# Altium schematic sheet QXZ-v1.0.SchDoc
size A4
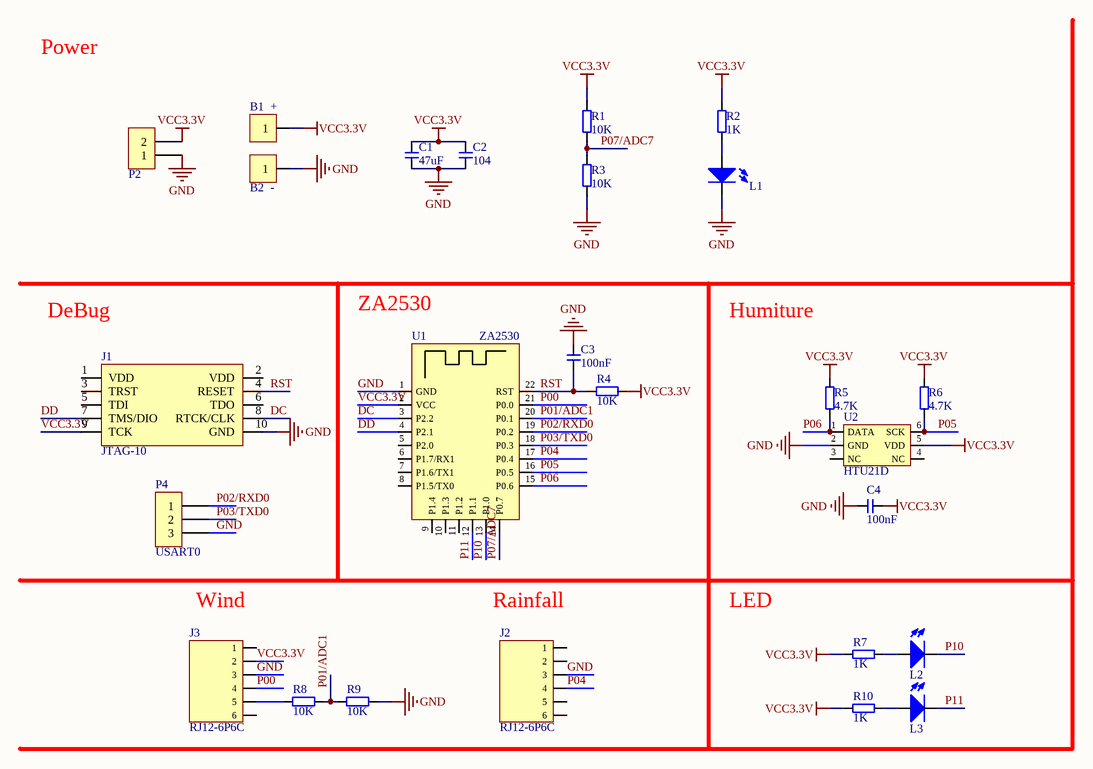
[diagram p0: QXZ-v1.0.SchDoc]

## Parts
B1  +  [BatteryContacts-5#]
B2  -  [BatteryContacts-5#]
C1  47uF  [CAP(0805)]
C2  104  [CAP(0603)]
C3  100nF  [CAP(0603)]
C4  100nF  [CAP(0603)]
J1  JTAG-10  [JTAG-10]
J2  RJ12-6P6C  [RJ12-6P6C-up]
J3  RJ12-6P6C  [RJ12-6P6C-up]
L1  LED  [led0805]  (value not drawn)
L2  LED  [led0805]  (value not drawn)
L3  LED  [led0805]  (value not drawn)
P2  Header2  [Header2]  (value not drawn)
P4  USART0  [HEADER3]
R1  10K  [RES0603]
R2  1K  [RES0603]
R3  10K  [RES0603]
R4  10K  [RES0603]
R5  4.7K  [RES0603]
R6  4.7K  [RES0603]
R7  1K  [RES0603]
R8  10K  [RES0603]
R9  10K  [RES0603]
R10  1K  [RES0603]
U1  ZA2530  [ZA2530A]
U2  HTU21D  [DFN6]

## Nets
GND: B2.1 C1.1 C2.1 C3.2 C4.1 J1.10(GND) J2.3 J3.3 L1.2 P2.1 P4.3 R3.1 R9.2 U1.1(GND) U2.2(GND)
VCC3.3V: B1.1 C1.2 C2.2 C4.2 J1.9(TCK) J3.2 P2.2 R1.2 R2.2 R4.2 R5.2 R6.2 R7.1 R10.1 U1.2(VCC) U2.5(VDD)
DC: J1.8(RTCK/CLK) U1.3(P2.2)
DD: J1.7(TMS/DIO) U1.4(P2.1)
P00: J3.4 U1.21(P0.0)
P01/ADC1: R8.2 R9.1 U1.20(P0.1)
P02/RXD0: P4.1 U1.19(P0.2)
P03/TXD0: P4.2 U1.18(P0.3)
P04: J2.4 U1.17(P0.4)
P05: R6.1 U1.16(P0.5) U2.6(SCK)
P06: R5.1 U1.15(P0.6) U2.1(DATA)
P07/ADC7: R1.1 R3.2 U1.14(P0.7)
P10: L2.2 U1.13(P1.0)
P11: L3.2 U1.12(P1.1)
RST: C3.1 J1.4(RESET) R4.1 U1.22(RST)
NetJ3_5: J3.5 R8.1
NetL1_1: L1.1 R2.1
NetL2_1: L2.1 R7.2
NetL3_1: L3.1 R10.2

Not connected (* = marked no-connect by the designer): J1 1(VDD) 2(VDD) 3(TRST) 5(TDI) 6(TDO); J2 1 2 5 6; J3 1 6; U1 5(P2.0) 6(P1.7/RX1) 7(P1.6/TX1) 8(P1.5/TX0) 9(P1.4) 10(P1.3) 11(P1.2); U2 3(NC) 4(NC)

## Notes on the sheet
- Power
- DeBug
- ZA2530
- Humiture
- (near J3) Wind
- (near J2) Rainfall
- LED

## Library data of the parts
B1 B2 = BatteryContacts-5#
C1 = Cap0805
C2-C4 = Cap0603
J2 J3 = RJ12-6P6C-up
L1-L3 = LED0805
P4 = Header3
R1-R10 = RES0603
U1 = ZA2530A